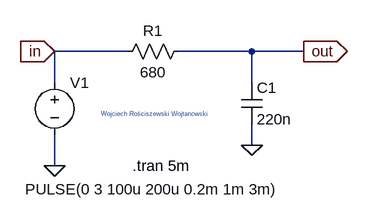
[diagram p0: schematic Tested RC Circuit.asc]
Tested RC Circuit.asc, the LTspice schematic file:
Version 4
SHEET 1 880 680
WIRE 208 32 96 32
WIRE 400 32 288 32
WIRE 480 32 400 32
WIRE 96 80 96 32
WIRE 400 80 400 32
WIRE 400 176 400 144
WIRE 96 208 96 160
FLAG 96 208 0
FLAG 400 176 0
FLAG 480 32 out
IOPIN 480 32 Out
FLAG 96 32 in
IOPIN 96 32 In
SYMBOL voltage 96 64 R0
WINDOW 3 -45 180 Left 2
WINDOW 123 0 0 Left 0
WINDOW 39 0 0 Left 0
SYMATTR Value PULSE(0 3 100u 200u 0.2m 1m 3m)
SYMATTR InstName V1
SYMBOL res 304 16 R90
WINDOW 0 0 56 VBottom 2
WINDOW 3 32 56 VTop 2
SYMATTR InstName R1
SYMATTR Value 680
SYMBOL cap 384 80 R0
SYMATTR InstName C1
SYMATTR Value 220n
TEXT 216 208 Left 2 !.tran 5m
TEXT 168 128 Left 0 ;Wojciech Rościszewski Wojtanowski

The netlist it stands for:
* Tested RC Circuit.asc
V1 in 0 PULSE(0 3 100u 200u 0.2m 1m 3m)
R1 out in 680
C1 out 0 220n
.tran 5m
* Wojciech Rościszewski Wojtanowski
.backanno
.end